# Altium schematic sheet MyCTRL_V2_Base_3.SchDoc
size A4; SheetNumber: 3; SheetTotal: 6
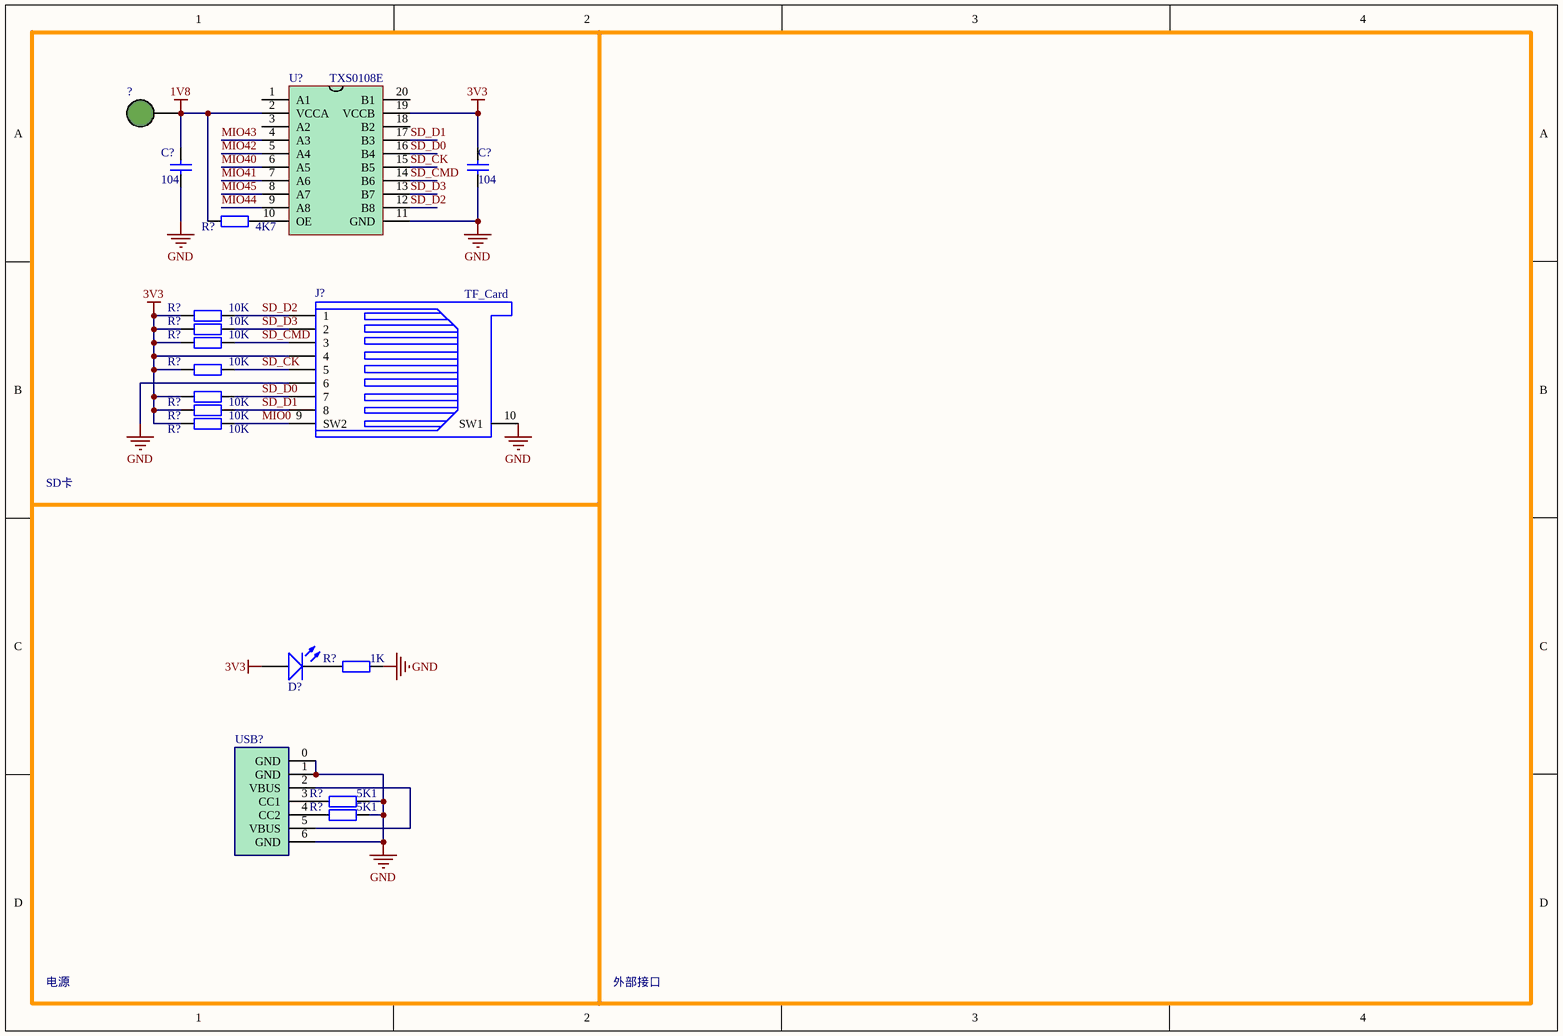
[diagram p0: MyCTRL_V2_Base_3.SchDoc]

## Parts
(Parts that share a designator on the sheet are numbered #1, #2 ... from top to bottom, then left to right.)
?  TEST_POINT_2mm  [TEST_POINT_2mm]  (value not drawn)
C?#1  104  [0402]
C?#2  104  [0402]
D?  LED  [LED_0603]  (value not drawn)
J?  TF_Card  [TF_card]
R?#1  4K7  [R_0402]
R?#2  10K  [R_0402]
R?#3  10K  [R_0402]
R?#4  10K  [R_0402]
R?#5  10K  [R_0402]
R?#6  10K  [R_0402]
R?#7  10K  [R_0402]
R?#8  10K  [R_0402]
R?#9  1K  [R_0402]
R?#10  5K1  [R_0402]
R?#11  5K1  [R_0402]
U?  TXS0108E  [TSSOP20]
USB?  USB_C_6P  [USB_C_6PIN]  (value not drawn)

## Nets
1V8: ?.1 C?#1.2 R?#1.1 U?.2(VCCA)
3V3: C?#2.2 D?.A J?.4 R?#2.1 R?#3.1 R?#4.1 R?#5.1 R?#6.1 R?#7.1 R?#8.1 U?.19(VCCB)
GND: C?#1.1 C?#2.1 J?.6 J?.10(SW1) R?#9.2 R?#10.1 R?#11.1 U?.11(GND) USB?.0(GND) USB?.1(GND) USB?.6(GND)
MIO0: J?.9(SW2) R?#8.2
MIO40: U?.6(A5)
MIO41: U?.7(A6)
MIO42: U?.5(A4)
MIO43: U?.4(A3)
MIO44: U?.9(A8)
MIO45: U?.8(A7)
SD_CK: J?.5 R?#5.2 U?.15(B5)
SD_CMD: J?.3 R?#4.2 U?.14(B6)
SD_D0: J?.7 R?#6.2 U?.16(B4)
SD_D1: J?.8 R?#7.2 U?.17(B3)
SD_D2: J?.1 R?#2.2 U?.12(B8)
SD_D3: J?.2 R?#3.2 U?.13(B7)
NetD?_K: D?.K R?#9.1
NetR?#1_2: R?#1.2 U?.10(OE)
NetR?#10_2: R?#10.2 USB?.3(CC1)
NetR?#11_2: R?#11.2 USB?.4(CC2)
NetUSB?_2: USB?.2(VBUS) USB?.5(VBUS)

Not connected (* = marked no-connect by the designer): U? 1(A1) 3(A2) 18(B2) 20(B1)

## Notes on the sheet
- SD卡
- 电源
- 外部接口

## Library data of the parts
C?#1 C?#2 = CAP_0402: 贴片电容 0402
D? = LED_0603: LED 0603
J? = TF_Card: TF卡座
R?#1-R?#11 = RES_0402: 电阻 0402